# Altium schematic sheet CONNECT.SchDoc
size A4
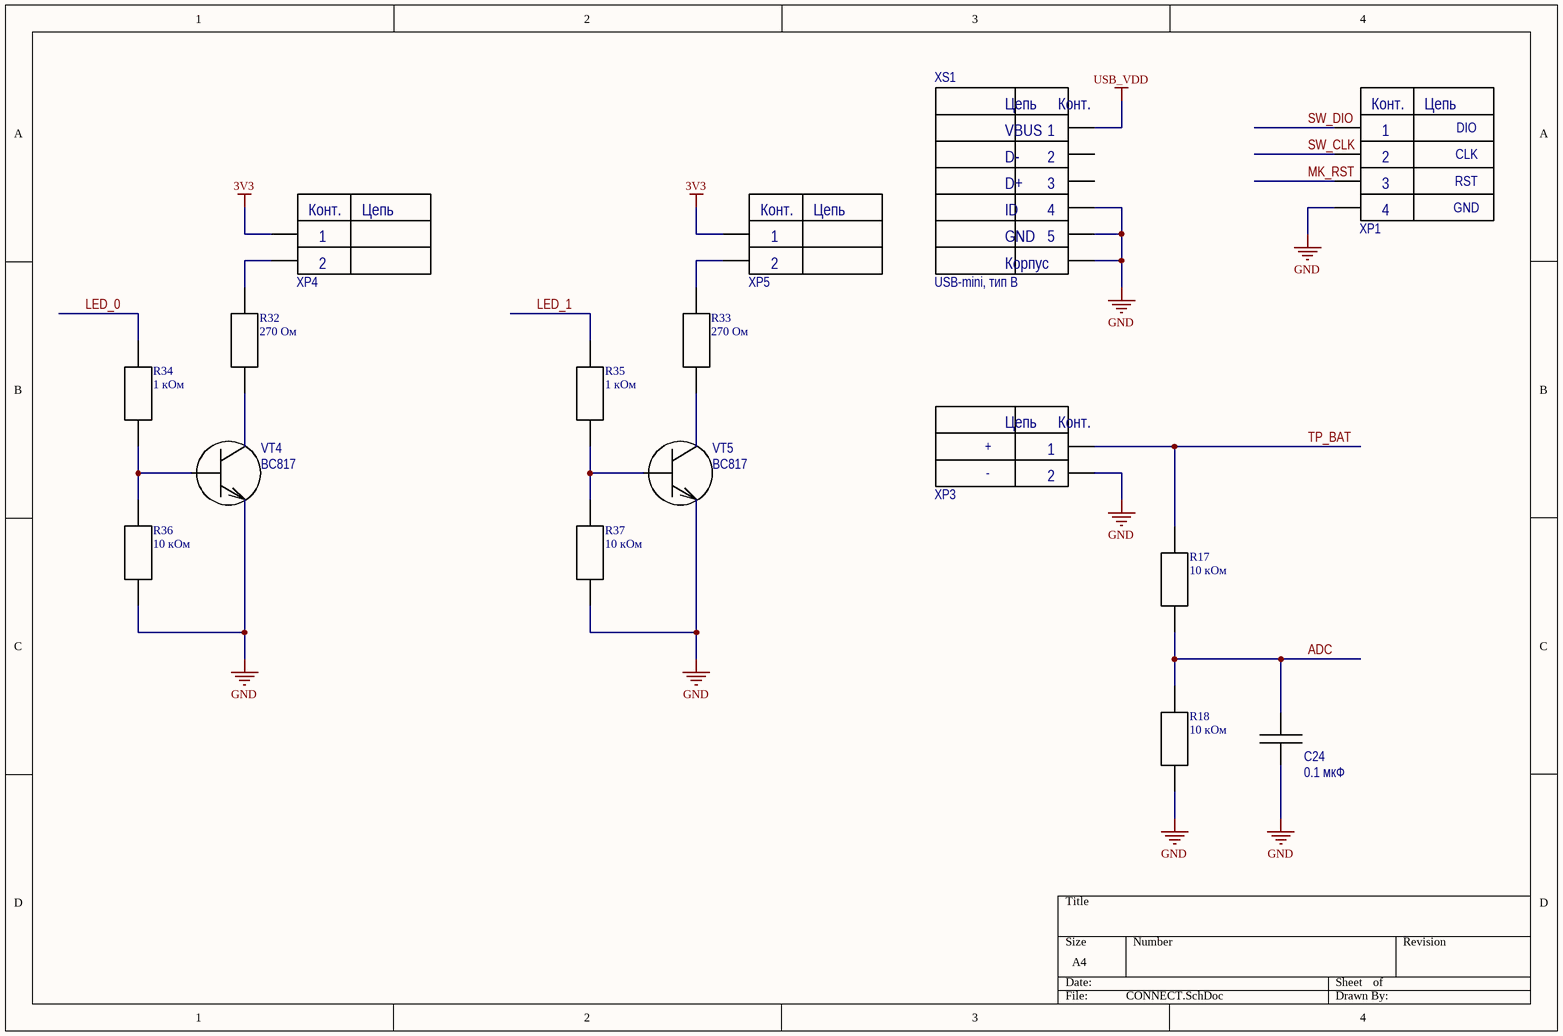
[diagram p0: CONNECT.SchDoc]

## Parts
C24  0.1 мкФ  [C 1206]
R17  10 кОм  [RES 0805]
R18  10 кОм  [RES 0805]
R32  270 Ом  [RES 0805]
R33  270 Ом  [RES 0805]
R34  1 кОм  [RES 0805]
R35  1 кОм  [RES 0805]
R36  10 кОм  [RES 0805]
R37  10 кОм  [RES 0805]
VT4  BC817  [SOT-23]
VT5  BC817  [SOT-23]
XP1  PLD-4  [PLD-4]  (value not drawn)
XP3  PLS-2  [PLS-2]  (value not drawn)
XP4  PLS-2  [PLS-2]  (value not drawn)
XP5  PLS-2  [PLS-2]  (value not drawn)
XS1  USB-mini, тип B  [USB_mini_B]

## Nets
3V3: XP4.1 XP5.1
GND: C24.2 R18.1 R36.2 R37.2 VT4.2(E) VT5.2(E) XP1.4 XP3.2 XS1.0 XS1.4(CASE) XS1.5(GND)
USB_VDD: XS1.1(VBUS)
ADC: C24.1 R17.1 R18.2
LED_0: R34.1
LED_1: R35.1
MK_RST: XP1.3
SW_CLK: XP1.2
SW_DIO: XP1.1
TP_BAT: R17.2 XP3.1
NetR32_1: R32.1 XP4.2
NetR32_2: R32.2 VT4.3(C)
NetR33_1: R33.1 XP5.2
NetR33_2: R33.2 VT5.3(C)
NetR34_2: R34.2 R36.1 VT4.1(B)
NetR35_2: R35.2 R37.1 VT5.1(B)

Not connected (* = marked no-connect by the designer): XS1 2(D-) 3(D+)

## Notes on the sheet
- DIO
- CLK
- RST
- GND
- +
- -
- (in symbol PLD-4) Конт.; Цепь
- (in symbol PLS-2) Цепь; Конт.
- (in symbol USB-mini_B) Цепь; Конт.; ID; Корпус

## Library data of the parts
C24 = CAP 1206: SMD Capacitor 1206; Manufacturer: /Укажите компанию-производителя/; Tolerance: /Укажите допуск в процентах/; Temperature coefficient: /Формат: ±? ppm/°C/; Type: Конденсатор керамический; TC: /Укажите тип диэлектрика/; Size: 1206; Temperature range: /Формат: -? ... ? °C/; Value: 0.1 мкФ
R17 R18 R32-R37 = RES 0805
VT4 VT5 = BC817: NPN general-purpose transistor; Manufacturer: NXP; Structure: n-p-n; Type: Транзистор биполярный; hFE: 160 ... 600; Max collector-emitter voltage: 45 В; Max collector-base voltage: 50 В; Max emitter-base voltage: 5 В; Max collector current: 0,5 А; Max collector peak current: 1 А; Power dissitipation: 0,25 Вт; fT: 100 МГц; Collector-emitter saturation voltage: 0,7 В; Base-emitter on voltage: 1,2 В; Specitication: ЭКБ ИП; Collector-base сapacitance: 3 пФ; Complement: BC807; Temperature range: -65 ... 150 °C
XP1 = PLD-4: PLD connector; Manufacturer: NONAME; Connector type: Вилка на плату; Number of contacts: 4; Type: Разъем штыревой
XP3-XP5 = PLS-2: PLS connector; Manufacturer: NONAME; Connector type: Вилка на плату; Number of contacts: 2; Type: Разъем штыревой
XS1 = USB-mini_B: USB-mini-B connector; Manufacturer: NONAME; Connector type: USB-mini, тип B на плату; Number of contacts: 5; Type: Разъем